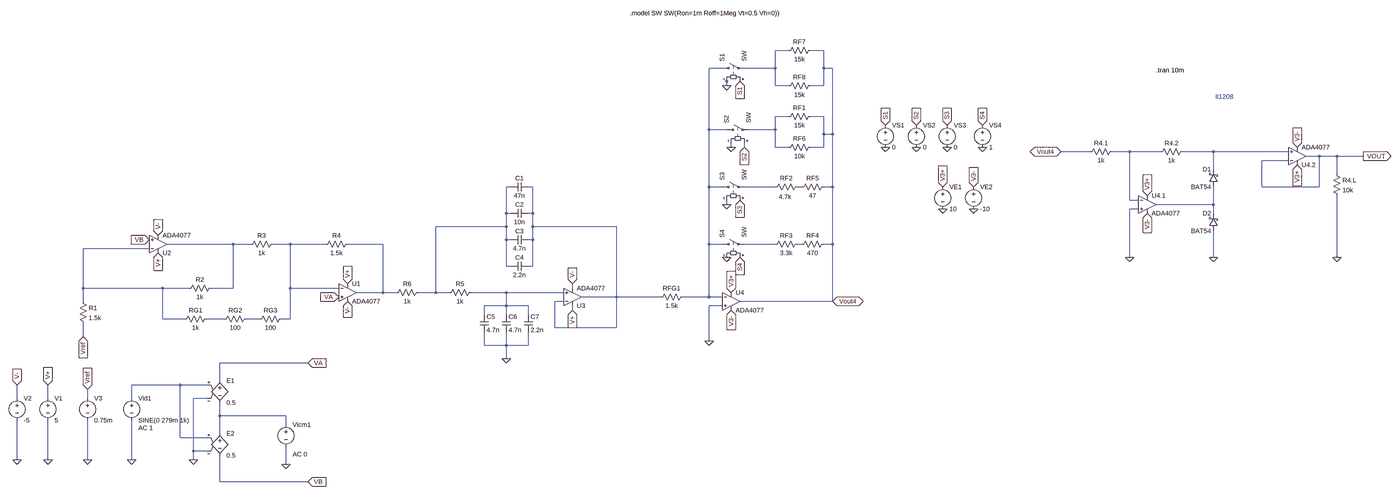
[diagram p0: schematic Etaj 4.asc, whole sheet]
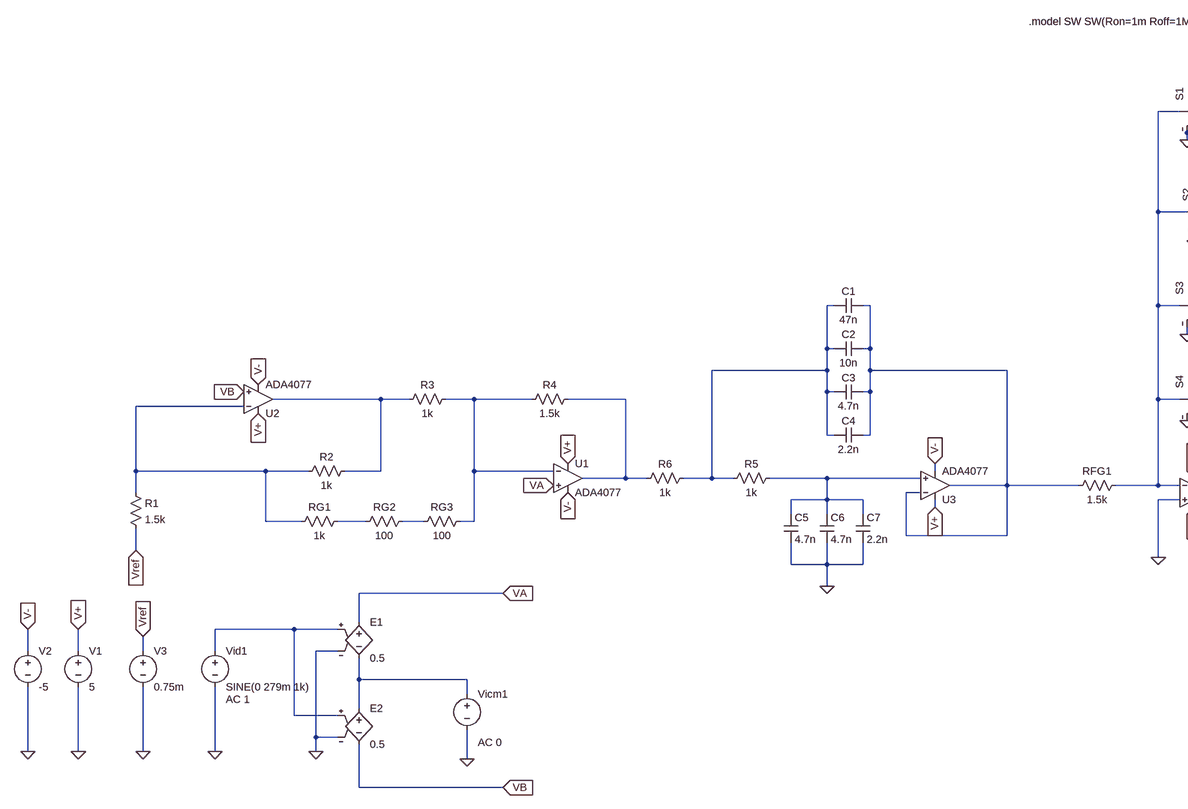
[diagram p1: schematic Etaj 4.asc, part, row 1 of 1, column 1 of 2]
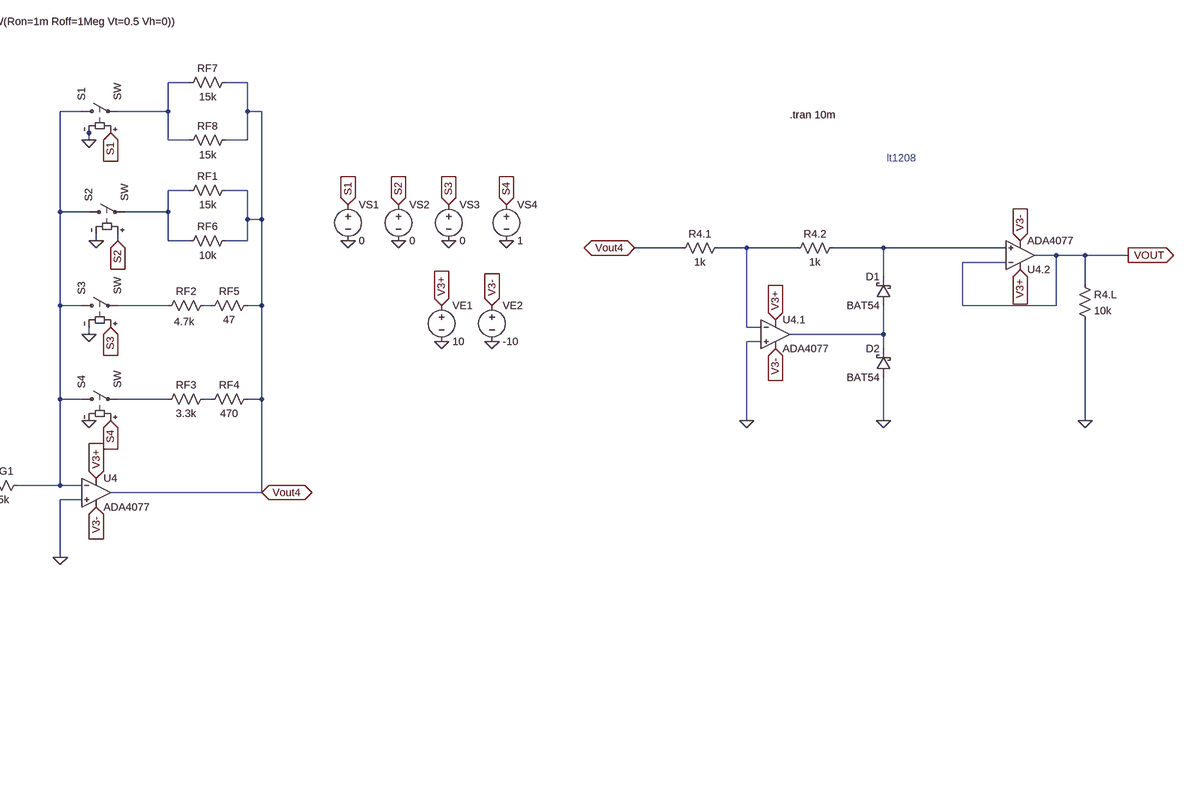
[diagram p2: schematic Etaj 4.asc, part, row 1 of 1, column 2 of 2]
Etaj 4.asc, the LTspice schematic file:
Version 4
SHEET 1 3688 952
WIRE 624 -688 576 -688
WIRE 752 -688 704 -688
WIRE 384 -624 336 -624
WIRE 576 -624 576 -688
WIRE 576 -624 464 -624
WIRE 752 -624 752 -688
WIRE 784 -624 752 -624
WIRE 400 -576 400 -592
WIRE 400 -560 400 -576
WIRE 576 -560 576 -624
WIRE 624 -560 576 -560
WIRE 752 -560 752 -624
WIRE 752 -560 704 -560
WIRE 624 -448 576 -448
WIRE 752 -448 704 -448
WIRE 336 -400 336 -624
WIRE 400 -400 336 -400
WIRE 576 -400 576 -448
WIRE 576 -400 480 -400
WIRE 752 -384 752 -448
WIRE 784 -384 784 -624
WIRE 784 -384 752 -384
WIRE 416 -336 416 -352
WIRE 464 -336 464 -352
WIRE 576 -336 576 -400
WIRE 624 -336 576 -336
WIRE 752 -336 752 -384
WIRE 752 -336 704 -336
WIRE 2240 -320 1968 -320
WIRE 2384 -320 2320 -320
WIRE 2496 -320 2384 -320
WIRE 2688 -320 2576 -320
WIRE 3072 -320 2688 -320
WIRE 3184 -304 3136 -304
WIRE 3248 -304 3184 -304
WIRE 3344 -304 3248 -304
WIRE 3072 -288 2976 -288
WIRE 2688 -256 2688 -320
WIRE 3248 -240 3248 -304
WIRE -384 -192 -400 -192
WIRE -304 -192 -320 -192
WIRE 336 -192 336 -400
WIRE 384 -192 336 -192
WIRE 576 -192 464 -192
WIRE 672 -192 656 -192
WIRE 784 -192 784 -384
WIRE 784 -192 752 -192
WIRE 2976 -192 2976 -288
WIRE 3184 -192 3184 -304
WIRE 3184 -192 2976 -192
WIRE 2384 -144 2384 -320
WIRE 2416 -144 2384 -144
WIRE 400 -128 400 -144
WIRE 2688 -128 2688 -192
WIRE 2688 -128 2480 -128
WIRE 2416 -112 2384 -112
WIRE -400 -96 -400 -192
WIRE -384 -96 -400 -96
WIRE -304 -96 -304 -192
WIRE -304 -96 -320 -96
WIRE 2688 -96 2688 -128
WIRE -400 -48 -400 -96
WIRE -400 -48 -656 -48
WIRE -304 -48 -304 -96
WIRE 0 -48 -304 -48
WIRE -400 0 -400 -48
WIRE -384 0 -400 0
WIRE -304 0 -304 -48
WIRE -304 0 -320 0
WIRE -1392 16 -1632 16
WIRE -1328 16 -1392 16
WIRE -1184 16 -1248 16
WIRE -1056 16 -1184 16
WIRE -848 16 -976 16
WIRE 336 16 336 -192
WIRE 384 16 336 16
WIRE 576 16 464 16
WIRE 672 16 656 16
WIRE 784 16 784 -192
WIRE 784 16 752 16
WIRE -1696 32 -1936 32
WIRE 2384 64 2384 -112
WIRE 2688 64 2688 -32
WIRE 3248 64 3248 -160
WIRE -400 96 -400 0
WIRE -384 96 -400 96
WIRE -304 96 -304 0
WIRE -304 96 -320 96
WIRE -1936 176 -1936 32
WIRE -1648 176 -1936 176
WIRE -1552 176 -1648 176
WIRE -1392 176 -1392 16
WIRE -1392 176 -1472 176
WIRE -1184 176 -1184 16
WIRE -1008 176 -1184 176
WIRE -160 176 -160 160
WIRE -848 192 -848 16
WIRE -848 192 -944 192
WIRE -800 192 -848 192
WIRE -656 192 -656 -48
WIRE -656 192 -720 192
WIRE -608 192 -656 192
WIRE -400 192 -528 192
WIRE -192 192 -400 192
WIRE 0 208 0 -48
WIRE 0 208 -128 208
WIRE 160 208 0 208
WIRE 336 208 336 16
WIRE 336 208 240 208
WIRE 384 208 336 208
WIRE -1936 224 -1936 176
WIRE -192 224 -224 224
WIRE 784 224 784 16
WIRE 784 224 448 224
WIRE -400 240 -400 192
WIRE -400 240 -480 240
WIRE -320 240 -400 240
WIRE 384 240 336 240
WIRE -160 256 -160 240
WIRE -480 272 -480 240
WIRE -400 272 -400 240
WIRE -320 272 -320 240
WIRE -1648 288 -1648 176
WIRE -1568 288 -1648 288
WIRE -1424 288 -1488 288
WIRE -1296 288 -1344 288
WIRE -1184 288 -1184 176
WIRE -1184 288 -1216 288
WIRE -224 320 -224 224
WIRE 0 320 0 208
WIRE 0 320 -224 320
WIRE -1936 352 -1936 304
WIRE 336 368 336 240
WIRE -480 384 -480 336
WIRE -400 384 -400 336
WIRE -400 384 -480 384
WIRE -320 384 -320 336
WIRE -320 384 -400 384
WIRE -400 432 -400 384
WIRE -1120 448 -1440 448
WIRE -1440 512 -1440 448
WIRE -1584 528 -1760 528
WIRE -1488 528 -1584 528
WIRE -2176 576 -2176 528
WIRE -2064 576 -2064 528
WIRE -1920 576 -1920 544
WIRE -1760 576 -1760 528
WIRE -1488 576 -1536 576
WIRE -1440 640 -1440 592
WIRE -1200 640 -1440 640
WIRE -1200 672 -1200 640
WIRE -1440 704 -1440 640
WIRE -1584 720 -1584 528
WIRE -1488 720 -1584 720
WIRE -1536 768 -1536 576
WIRE -1488 768 -1536 768
WIRE -2176 800 -2176 656
WIRE -2064 800 -2064 656
WIRE -1920 800 -1920 656
WIRE -1760 800 -1760 656
WIRE -1536 800 -1536 768
WIRE -1200 816 -1200 752
WIRE -1440 880 -1440 784
WIRE -1120 880 -1440 880
FLAG -2064 800 0
FLAG -2176 800 0
FLAG -2064 528 V+
IOPIN -2064 528 In
FLAG -2176 528 V-
IOPIN -2176 528 In
FLAG -976 224 V-
IOPIN -976 224 In
FLAG -1664 -16 V-
IOPIN -1664 -16 In
FLAG -976 160 V+
IOPIN -976 160 In
FLAG -1664 48 V+
IOPIN -1664 48 In
FLAG -1008 208 VA
IOPIN -1008 208 In
FLAG -1696 0 VB
IOPIN -1696 0 In
FLAG -1760 800 0
FLAG -1536 800 0
FLAG -1200 816 0
FLAG -1120 448 VA
IOPIN -1120 448 In
FLAG -1120 880 VB
IOPIN -1120 880 In
FLAG -1920 544 Vref
IOPIN -1920 544 In
FLAG -1936 352 Vref
IOPIN -1936 352 In
FLAG -1920 800 0
FLAG -160 256 V+
IOPIN -160 256 In
FLAG -160 160 V-
IOPIN -160 160 In
FLAG -400 432 0
FLAG 336 368 0
FLAG 416 192 V3+
IOPIN 416 192 In
FLAG 416 256 V3-
IOPIN 416 256 In
FLAG 400 -560 0
FLAG 416 -336 0
FLAG 400 -128 0
FLAG 400 64 0
FLAG 448 -576 S1
IOPIN 448 -576 In
FLAG 464 -336 S2
IOPIN 464 -336 In
FLAG 448 -144 S3
IOPIN 448 -144 In
FLAG 448 64 S4
IOPIN 448 64 In
FLAG 976 -336 0
FLAG 1088 -336 0
FLAG 1200 -336 0
FLAG 1328 -336 0
FLAG 976 -416 S1
IOPIN 976 -416 In
FLAG 1088 -416 S2
IOPIN 1088 -416 In
FLAG 1200 -416 S3
IOPIN 1200 -416 In
FLAG 1328 -416 S4
IOPIN 1328 -416 In
FLAG 1184 -112 0
FLAG 1296 -112 0
FLAG 1184 -192 V3+
IOPIN 1184 -192 In
FLAG 1296 -192 V3-
IOPIN 1296 -192 In
FLAG 2384 64 0
FLAG 2688 64 0
FLAG 3248 64 0
FLAG 2448 -160 V3+
IOPIN 2448 -160 In
FLAG 3104 -272 V3+
IOPIN 3104 -272 In
FLAG 3104 -336 V3-
IOPIN 3104 -336 In
FLAG 2448 -96 V3-
IOPIN 2448 -96 In
FLAG 3344 -304 VOUT
IOPIN 3344 -304 Out
FLAG 784 224 Vout4
IOPIN 784 224 BiDir
FLAG 1968 -320 Vout4
IOPIN 1968 -320 BiDir
DATAFLAG 0 208 ""
DATAFLAG 784 224 ""
SYMBOL res -1952 208 R0
SYMATTR InstName R1
SYMATTR Value 1.5k
SYMBOL res -1456 160 R90
WINDOW 0 0 56 VBottom 2
WINDOW 3 32 56 VTop 2
SYMATTR InstName R2
SYMATTR Value 1k
SYMBOL res -1232 0 R90
WINDOW 0 0 56 VBottom 2
WINDOW 3 32 56 VTop 2
SYMATTR InstName R3
SYMATTR Value 1k
SYMBOL res -960 0 R90
WINDOW 0 0 56 VBottom 2
WINDOW 3 32 56 VTop 2
SYMATTR InstName R4
SYMATTR Value 1.5k
SYMBOL res -1472 272 R90
WINDOW 0 0 56 VBottom 2
WINDOW 3 32 56 VTop 2
SYMATTR InstName RG1
SYMATTR Value 1k
SYMBOL voltage -2064 560 R0
WINDOW 123 24 44 Left 2
WINDOW 39 0 0 Left 0
SYMATTR InstName V1
SYMATTR Value 5
SYMBOL voltage -2176 560 R0
WINDOW 123 24 44 Left 2
WINDOW 39 0 0 Left 0
SYMATTR InstName V2
SYMATTR Value -5
SYMBOL e -1440 496 R0
SYMATTR InstName E1
SYMATTR Value 0.5
SYMBOL e -1440 688 R0
SYMATTR InstName E2
SYMATTR Value 0.5
SYMBOL voltage -1200 656 R0
WINDOW 123 24 124 Left 2
WINDOW 39 0 0 Left 0
SYMATTR Value2 AC 0
SYMATTR InstName Vicm1
SYMATTR Value ""
SYMBOL voltage -1760 560 R0
WINDOW 123 24 124 Left 2
WINDOW 39 0 0 Left 0
SYMATTR Value2 AC 1
SYMATTR InstName Vid1
SYMATTR Value SINE(0 279m 1k)
SYMBOL voltage -1920 560 R0
WINDOW 123 0 0 Left 0
WINDOW 39 0 0 Left 0
SYMATTR InstName V3
SYMATTR Value 0.75m
SYMBOL res -1328 272 R90
WINDOW 0 0 56 VBottom 2
WINDOW 3 32 56 VTop 2
SYMATTR InstName RG2
SYMATTR Value 100
SYMBOL res -1200 272 R90
WINDOW 0 0 56 VBottom 2
WINDOW 3 32 56 VTop 2
SYMATTR InstName RG3
SYMATTR Value 100
SYMBOL OpAmps\\ADA4077 -976 128 R0
SYMATTR InstName U1
SYMBOL OpAmps\\ADA4077 -1664 80 M180
SYMATTR InstName U2
SYMBOL OpAmps\\ADA4077 -160 272 M180
SYMATTR InstName U3
SYMBOL res -512 176 R90
WINDOW 0 0 56 VBottom 2
WINDOW 3 32 56 VTop 2
SYMATTR InstName R5
SYMATTR Value 1k
SYMBOL res -704 176 R90
WINDOW 0 0 56 VBottom 2
WINDOW 3 32 56 VTop 2
SYMATTR InstName R6
SYMATTR Value 1k
SYMBOL cap -320 -208 R90
WINDOW 0 0 32 VBottom 2
WINDOW 3 32 32 VTop 2
SYMATTR InstName C1
SYMATTR Value 47n
SYMBOL cap -320 -112 R90
WINDOW 0 0 32 VBottom 2
WINDOW 3 32 32 VTop 2
SYMATTR InstName C2
SYMATTR Value 10n
SYMBOL cap -320 -16 R90
WINDOW 0 0 32 VBottom 2
WINDOW 3 32 32 VTop 2
SYMATTR InstName C3
SYMATTR Value 4.7n
SYMBOL cap -320 80 R90
WINDOW 0 0 32 VBottom 2
WINDOW 3 32 32 VTop 2
SYMATTR InstName C4
SYMATTR Value 2.2n
SYMBOL cap -496 272 R0
SYMATTR InstName C5
SYMATTR Value 4.7n
SYMBOL cap -416 272 R0
SYMATTR InstName C6
SYMATTR Value 4.7n
SYMBOL cap -336 272 R0
SYMATTR InstName C7
SYMATTR Value 2.2n
SYMBOL OpAmps\\ADA4077 416 160 R0
SYMATTR InstName U4
SYMBOL sw 368 -624 R270
SYMATTR InstName S1
SYMBOL sw 384 -400 R270
SYMATTR InstName S2
SYMBOL sw 368 -192 R270
SYMATTR InstName S3
SYMBOL sw 368 16 R270
SYMATTR InstName S4
SYMBOL res 256 192 R90
WINDOW 0 0 56 VBottom 2
WINDOW 3 32 56 VTop 2
SYMATTR InstName RFG1
SYMATTR Value 1.5k
SYMBOL res 720 -464 R90
WINDOW 0 0 56 VBottom 2
WINDOW 3 32 56 VTop 2
SYMATTR InstName RF1
SYMATTR Value 15k
SYMBOL res 672 -208 R90
WINDOW 0 0 56 VBottom 2
WINDOW 3 36 60 VTop 2
SYMATTR InstName RF2
SYMATTR Value 4.7k
SYMBOL res 672 0 R90
WINDOW 0 0 56 VBottom 2
WINDOW 3 32 56 VTop 2
SYMATTR InstName RF3
SYMATTR Value 3.3k
SYMBOL res 768 0 R90
WINDOW 0 0 56 VBottom 2
WINDOW 3 32 56 VTop 2
SYMATTR InstName RF4
SYMATTR Value 470
SYMBOL res 768 -208 R90
WINDOW 0 0 56 VBottom 2
WINDOW 3 32 56 VTop 2
SYMATTR InstName RF5
SYMATTR Value 47
SYMBOL res 720 -352 R90
WINDOW 0 0 56 VBottom 2
WINDOW 3 33 56 VTop 2
SYMATTR InstName RF6
SYMATTR Value 10k
SYMBOL res 720 -704 R90
WINDOW 0 0 56 VBottom 2
WINDOW 3 32 56 VTop 2
SYMATTR InstName RF7
SYMATTR Value 15k
SYMBOL res 720 -576 R90
WINDOW 0 0 56 VBottom 2
WINDOW 3 33 56 VTop 2
SYMATTR InstName RF8
SYMATTR Value 15k
SYMBOL voltage 976 -432 R0
WINDOW 123 0 0 Left 0
WINDOW 39 0 0 Left 0
SYMATTR InstName VS1
SYMATTR Value 0
SYMBOL voltage 1088 -432 R0
WINDOW 123 0 0 Left 0
WINDOW 39 0 0 Left 0
SYMATTR InstName VS2
SYMATTR Value 0
SYMBOL voltage 1200 -432 R0
WINDOW 123 0 0 Left 0
WINDOW 39 0 0 Left 0
SYMATTR InstName VS3
SYMATTR Value 0
SYMBOL voltage 1328 -432 R0
WINDOW 123 0 0 Left 0
WINDOW 39 0 0 Left 0
SYMATTR InstName VS4
SYMATTR Value 1
SYMBOL voltage 1184 -208 R0
SYMATTR InstName VE1
SYMATTR Value 10
SYMBOL voltage 1296 -208 R0
SYMATTR InstName VE2
SYMATTR Value -10
SYMBOL res 2336 -336 R90
WINDOW 0 0 56 VBottom 2
WINDOW 3 32 56 VTop 2
SYMATTR InstName R4.1
SYMATTR Value 1k
SYMBOL res 2592 -336 R90
WINDOW 0 0 56 VBottom 2
WINDOW 3 32 56 VTop 2
SYMATTR InstName R4.2
SYMATTR Value 1k
SYMBOL schottky 2704 -192 R180
WINDOW 0 24 64 Left 2
WINDOW 3 24 0 Left 2
SYMATTR InstName D1
SYMATTR Value BAT54
SYMATTR Description Diode
SYMATTR Type diode
SYMBOL schottky 2704 -32 R180
WINDOW 0 24 64 Left 2
WINDOW 3 24 0 Left 2
SYMATTR InstName D2
SYMATTR Value BAT54
SYMATTR Description Diode
SYMATTR Type diode
SYMBOL res 3232 -256 R0
SYMATTR InstName R4.L
SYMATTR Value 10k
SYMBOL OpAmps\\ADA4077 2448 -192 R0
SYMATTR InstName U4.1
SYMBOL OpAmps\\ADA4077 3104 -240 M180
SYMATTR InstName U4.2
TEXT 48 -824 Left 2 !.model SW SW(Ron=1m Roff=1Meg Vt=0.5 Vh=0))
TEXT 2480 -616 Left 2 !.tran 10m
TEXT 2696 -520 Left 2 ;lt1208

The netlist it stands for:
* Etaj 4.asc
R1 N016 Vref 1.5k
R2 N011 N016 1k
R3 N012 N011 1k
R4 N013 N012 1.5k
RG1 N018 N016 1k
V1 V+ 0 5
V2 V- 0 -5
E1 VA N021 N020 0 0.5
E2 N021 VB N020 0 0.5
Vicm1 N021 0 AC 0
Vid1 N020 0 SINE(0 279m 1k) AC 1
V3 Vref 0 0.75m
RG2 N019 N018 100
RG3 N012 N019 100
XU1 VA N012 V+ V- N013 ADA4077  ; pins In+ In- V+ V- OUT
XU2 VB N016 V+ V- N011 ADA4077  ; pins In+ In- V+ V- OUT
XU3 N017 N007 V+ V- N007 ADA4077  ; pins In+ In- V+ V- OUT
R5 N017 N006 1k
R6 N006 N013 1k
C1 N007 N006 47n
C2 N007 N006 10n
C3 N007 N006 4.7n
C4 N007 N006 2.2n
C5 N017 0 4.7n
C6 N017 0 4.7n
C7 N017 0 2.2n
XU4 0 N002 V3+ V3- Vout4 ADA4077  ; pins In+ In- V+ V- OUT
S1 N002 N001 S1 0 SW
S2 N002 N003 S2 0 SW
S3 N002 N008 S3 0 SW
S4 N002 N014 S4 0 SW
RFG1 N002 N007 1.5k
RF1 Vout4 N003 15k
RF2 N009 N008 4.7k
RF3 N015 N014 3.3k
RF4 Vout4 N015 470
RF5 Vout4 N009 47
RF6 Vout4 N003 10k
RF7 Vout4 N001 15k
RF8 Vout4 N001 15k
VS1 S1 0 0
VS2 S2 0 0
VS3 S3 0 0
VS4 S4 0 1
VE1 V3+ 0 10
VE2 V3- 0 -10
R4.1 N004 Vout4 1k
R4.2 N005 N004 1k
D1 N010 N005 BAT54
D2 0 N010 BAT54
R4.L VOUT 0 10k
XU4.1 0 N004 V3+ V3- N010 ADA4077  ; pins In+ In- V+ V- OUT
XU4.2 N005 VOUT V3+ V3- VOUT ADA4077  ; pins In+ In- V+ V- OUT
.model D D
.lib standard.dio
.model SW SW(Ron=1m Roff=1Meg Vt=0.5 Vh=0))
.tran 10m
* lt1208
.backanno
.end